# Altium schematic sheet XL_N76E003K2._POWER_V17.SchDoc
size A4
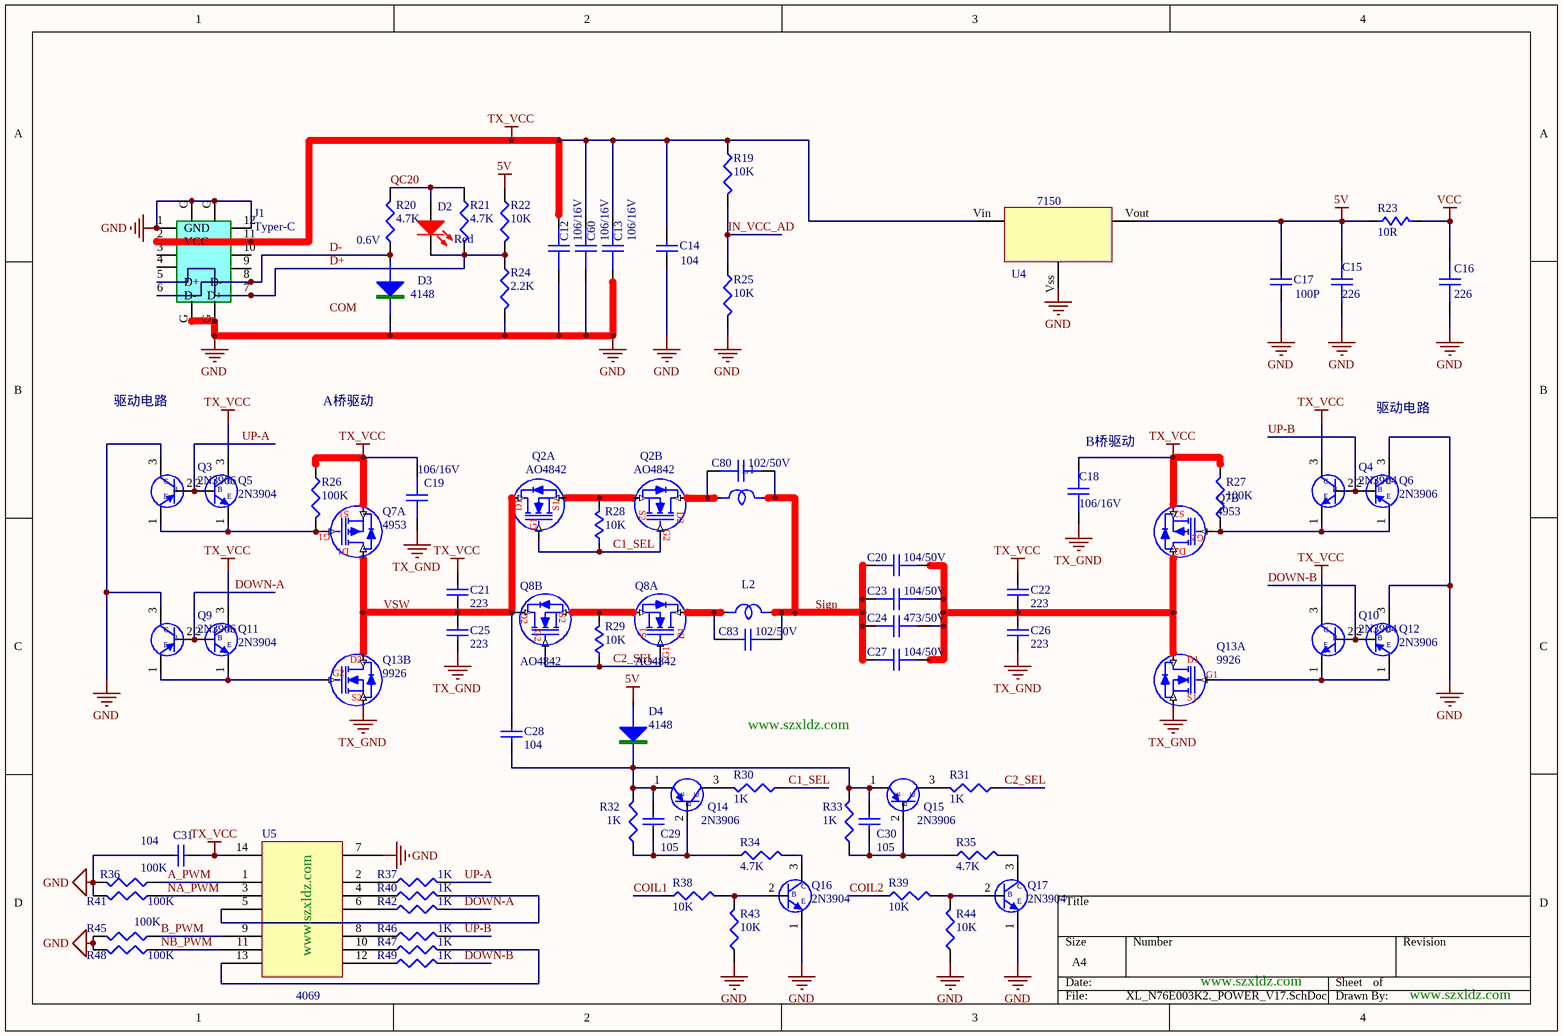
[diagram p0: XL_N76E003K2._POWER_V17.SchDoc]

## Parts
C12  106/16V  [C0805]
C13  106/16V  [C0805]
C14  104  [C0402]
C15  226  [C0805]
C16  226  [C0805]
C17  100P  [C0402]
C18  106/16V  [C0805]
C19  106/16V  [C0805]
C20  104/50V  [C1206]
C21  223  [C0603]
C22  223  [C1206]
C23  104/50V  [C1206]
C24  473/50V  [C1206]
C25  223  [C0603]
C26  223  [C1206]
C27  104/50V  [C1206]
C28  104  [C0402]
C29  105  [C0402]
C30  105  [C0402]
C31  104  [C0402]
C60  106/16V  [C0805]
C80  102/50V  [C1206]
C83  102/50V  [C1206]
D2  Red  [LED0603]
D3  4148  [SOD323]
D4  4148  [SOD323]
J1  Typer-C  [USB -MRO17]
L1  (no value)  [L5mm]
L2  (no value)  [L5mm]
Q2  AO4842  [SOP8D]  (parts A,B of 2)
Q3  2N3906  [SOT-23]
Q4  2N3904  [SOT-23]
Q5  2N3904  [SOT-23]
Q6  2N3906  [SOT-23]
Q7  4953  [SOP8D]  (parts A,B of 2)
Q8  AO4842  [SOP8D]  (parts A,B of 2)
Q9  2N3906  [SOT-23]
Q10  2N3904  [SOT-23]
Q11  2N3904  [SOT-23]
Q12  2N3906  [SOT-23]
Q13  9926  [SOP8D]  (parts A,B of 2)
Q14  2N3906  [SOT-23]
Q15  2N3906  [SOT-23]
Q16  2N3904  [SOT-23]
Q17  2N3904  [SOT-23]
R19  10K  [R0402]
R20  4.7K  [R0402]
R21  4.7K  [R0402]
R22  10K  [R0402]
R23  10R  [R0402]
R24  2.2K  [R0402]
R25  10K  [R0402]
R26  100K  [R0402]
R27  100K  [R0402]
R28  10K  [R0402]
R29  10K  [R0402]
R30  1K  [R0402]
R31  1K  [R0402]
R32  1K  [R0402]
R33  1K  [R0402]
R34  4.7K  [R0402]
R35  4.7K  [R0402]
R36  100K  [R0402]
R37  1K  [R0402]
R38  10K  [R0402]
R39  10K  [R0402]
R40  1K  [R0402]
R41  100K  [R0402]
R42  1K  [R0402]
R43  10K  [R0402]
R44  10K  [R0402]
R45  100K  [R0402]
R46  1K  [R0402]
R47  1K  [R0402]
R48  100K  [R0402]
R49  1K  [R0402]
U4  7150  [SOT89a]
U5  4069  [SOP14]

## Nets
5V: C15.1 C17.1 D4.1 R22.2 R23.1 U4.Vout
GND: C12.2 C13.2 C14.2 C15.2 C16.1 C17.2 C31.1 C60.2 D3.2 J1.1(GND) J1.12 J1.G Q3.3(C) Q6.3(C) Q9.3(C) Q12.3(C) Q16.1(E) Q17.1(E) R24.1 R25.1 R36.2 R41.2 R43.1 R44.1 R45.2 R48.2 U4.Vss U5.7
TX_GND: C18.2 C19.2 C25.1 C26.1 Q13.E1(S1) Q13.E2(S2)
TX_VCC: C12.1 C13.1 C14.1 C18.1 C19.1 C21.2 C22.2 C31.2 C60.1 J1.2(VCC) J1.11 Q4.3(C) Q5.3(C) Q7.E1(S1) Q7.E2(S2) Q10.3(C) Q11.3(C) R19.2 R26.1 R27.2 U4.Vin U5.14
VCC: C16.2 R23.2
A_PWM: R36.1 U5.1
B_PWM: R45.1 U5.9
C1_SEL: Q2.B1(G1) Q2.B2(G2) R28.1 R30.1
C2_SEL: Q8.B1(G1) Q8.B2(G2) R29.1 R31.1
COIL1: R38.1
COIL2: R39.1
D+: D2.2(K) J1.5(D+) J1.7(D+) R21.1 R22.1 R24.2
D-: D3.1 J1.6(D-) J1.8(D-) R20.2
DOWN-A: Q9.2(B) Q11.2(B) R42.2
DOWN-B: Q10.2(B) Q12.2(B) R49.2
IN_VCC_AD: R19.1 R25.2
NA_PWM: R41.1 U5.3
NB_PWM: R48.1 U5.11
QC20: D2.1(A) R20.1 R21.2
Sign: C20.1 C23.1 C24.1 C27.1 C80.2 C83.2 L1.2 L2.2
UP-A: Q3.2(B) Q5.2(B) R37.2
UP-B: Q4.2(B) Q6.2(B) R46.2
VSW: C21.1 C25.2 C28.1 Q2.C1(D1) Q7.C1(D1) Q8.C2(D2) Q13.C2(D2)
NetC20_2: C20.2 C22.1 C23.2 C24.2 C26.2 C27.2 Q7.C2(D2) Q13.C1(D1)
NetC28_2: C28.2 C29.1 C30.1 D4.2 Q14.1(E) Q15.1(E) R32.2 R33.2
NetC29_2: C29.2 Q14.2(B) R32.1 R34.1
NetC30_2: C30.2 Q15.2(B) R33.1 R35.1
NetC80_1: C80.1 L1.1 Q2.C2(D2)
NetC83_1: C83.1 L2.1 Q8.C1(D1)
NetQ2_E1: Q2.E1(S1) Q2.E2(S2) R28.2
NetQ3_1: Q3.1(E) Q5.1(E) Q7.B1(G1) R26.2
NetQ4_1: Q4.1(E) Q6.1(E) Q7.B2(G2) R27.1
NetQ8_E1: Q8.E1(S1) Q8.E2(S2) R29.2
NetQ9_1: Q9.1(E) Q11.1(E) Q13.B2(G2)
NetQ10_1: Q10.1(E) Q12.1(E) Q13.B1(G1)
NetQ14_3: Q14.3(C) R30.2
NetQ15_3: Q15.3(C) R31.2
NetQ16_2: Q16.2(B) R38.2 R43.2
NetQ16_3: Q16.3(C) R34.2
NetQ17_2: Q17.2(B) R39.2 R44.2
NetQ17_3: Q17.3(C) R35.2
NetR37_1: R37.1 U5.2
NetR40_1: R40.1 U5.4
NetR40_2: R40.2 U5.5
NetR42_1: R42.1 U5.6
NetR46_1: R46.1 U5.8
NetR47_1: R47.1 U5.10
NetR47_2: R47.2 U5.13
NetR49_1: R49.1 U5.12

Not connected (* = marked no-connect by the designer): J1 3 4 9 10

## Notes on the sheet
- 0.6V
- 驱动电路
- A桥驱动
- (near C18) B桥驱动
- www.szxldz.com
- (near U5) www.szxldz.com
- Labels drawn without touching a wire or pin: COM

## Library data of the parts
C12 C13 C15 C16 C18-C20 C23 C24 C27 C60 C80 C83 = CH
C14 C28 C31 = Cap: Capacitor; Published: 8-Jun-2000; LatestRevisionDate: 17-Jul-2002; LatestRevisionNote: Re-released for DXP Platform.; Publisher: Altium Limited; Value: 104
C17 C21 C22 C25 C26 C29 C30 = Cap: Capacitor; Value: 104; Published: 8-Jun-2000; LatestRevisionDate: 17-Jul-2002; LatestRevisionNote: Re-released for DXP Platform.; Publisher: Altium Limited
D2 = LED02
D3 D4 = D0: 1N4001
J1 = USB12P
L1 L2 = L: 1uH
Q2 Q8 Q13 = MOSFETN2
Q3 Q6 Q9 Q12 Q14 Q15 = PNP01
Q4 Q5 Q10 Q11 Q16 Q17 = NPN01
Q7 = MOSFETP2
R19-R22 R24-R27 R34-R36 R38 R39 R41 R43-R45 R48 = R: 1K
R23 R28 R29 = Res01
R30-R33 R37 R40 R42 R46 R47 R49 = R
U4 = VOLTREG
U5 = CD4069